# Altium project fff.PrjPcb
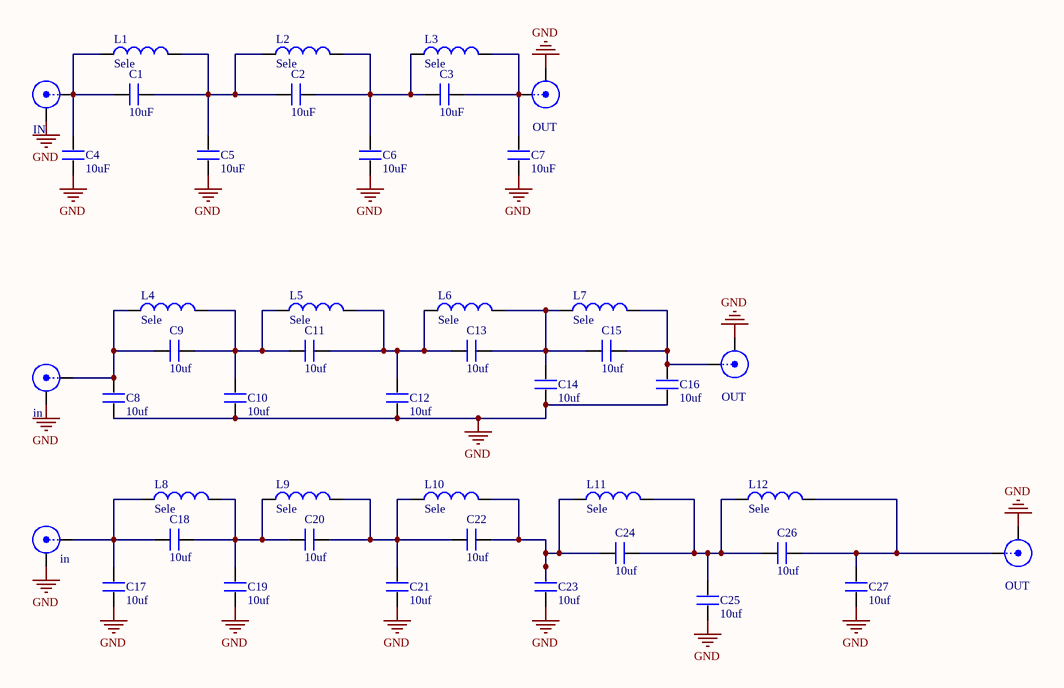
[diagram p0: fff.SchDoc]
1 sheet, 45 parts. Net scope: global (net labels, ports and power ports of the same name join across sheets).
Board file: fff.PcbDoc

## Sheet fff.SchDoc
size A4

### Parts
(Parts that share a designator on the sheet are numbered #1, #2 ... from top to bottom, then left to right.)
C1  10uF  [0603C]
C2  10uF  [0603C]
C3  10uF  [0603C]
C4  10uF  [0603C]
C5  10uF  [0603C]
C6  10uF  [0603C]
C7  10uF  [0603C]
C8  10uf  [0603C]
C9  10uf  [0603C]
C10  10uf  [0603C]
C11  10uf  [0603C]
C12  10uf  [0603C]
C13  10uf  [0603C]
C14  10uf  [0603C]
C15  10uf  [0603C]
C16  10uf  [0603C]
C17  10uf  [0603C]
C18  10uf  [0603C]
C19  10uf  [0603C]
C20  10uf  [0603C]
C21  10uf  [0603C]
C22  10uf  [0603C]
C23  10uf  [0603C]
C24  10uf  [0603C]
C25  10uf  [0603C]
C26  10uf  [0603C]
C27  10uf  [0603C]
IN#1  SMA  [SMA]  (value not drawn)
in#2  SMA  [SMA]  (value not drawn)
in#3  SMA  [SMA]  (value not drawn)
L1  Sele  [0603L]
L2  Sele  [0603L]
L3  Sele  [0603L]
L4  Sele  [0603L]
L5  Sele  [0603L]
L6  Sele  [0603L]
L7  Sele  [0603L]
L8  Sele  [0603L]
L9  Sele  [0603L]
L10  Sele  [0603L]
L11  Sele  [0603L]
L12  Sele  [0603L]
OUT#1  SMA  [SMA]  (value not drawn)
OUT#2  SMA  [SMA]  (value not drawn)
OUT#3  SMA  [SMA]  (value not drawn)

### Nets
GND: C4.1 C5.1 C6.1 C7.1 C8.1 C10.2 C12.1 C14.2 C16.1 C17.1 C19.2 C21.1 C23.2 C25.1 C27.2 IN#1.2(Y) in#2.2(Y) in#3.2(Y) OUT#1.2(Y) OUT#2.2(Y) OUT#3.2(Y)
NetC1_1: C1.1 C4.2 IN#1.1(X) L1.1
NetC1_2: C1.2 C2.1 C5.2 L1.2 L2.1
NetC2_2: C2.2 C3.1 C6.2 L2.2 L3.1
NetC3_2: C3.2 C7.2 L3.2 OUT#1.1(X)
NetC8_2: C8.2 C9.2 in#2.1(X) L4.1
NetC9_1: C9.1 C10.1 C11.1 L4.2 L5.1
NetC11_2: C11.2 C12.2 C13.2 L5.2 L6.1
NetC13_1: C13.1 C14.1 C15.1 L6.2 L7.1
NetC15_2: C15.2 C16.2 L7.2 OUT#2.1(X)
NetC17_2: C17.2 C18.2 in#3.1(X) L8.1
NetC18_1: C18.1 C19.1 C20.1 L8.2 L9.1
NetC20_2: C20.2 C21.2 C22.2 L9.2 L10.1
NetC22_1: C22.1 C23.1 C24.1 L10.2 L11.1
NetC24_2: C24.2 C25.2 C26.2 L11.2 L12.1
NetC26_1: C26.1 C27.1 L12.2 OUT#3.1(X)

### Library data of the parts
C1-C27 = C: Capacitor
IN#1 in#2 in#3 OUT#1-OUT#3 = SMA: SMA Connector
L1-L12 = Inductor: Value: 100uH; Published: 8-Jun-2000; Revision: July-2002: Re-released for DXP Platform.; Publisher: Altium Limited